# EAGLE design Pololu Magnetic Encoder (AS5050) (EAGLE 6.4)
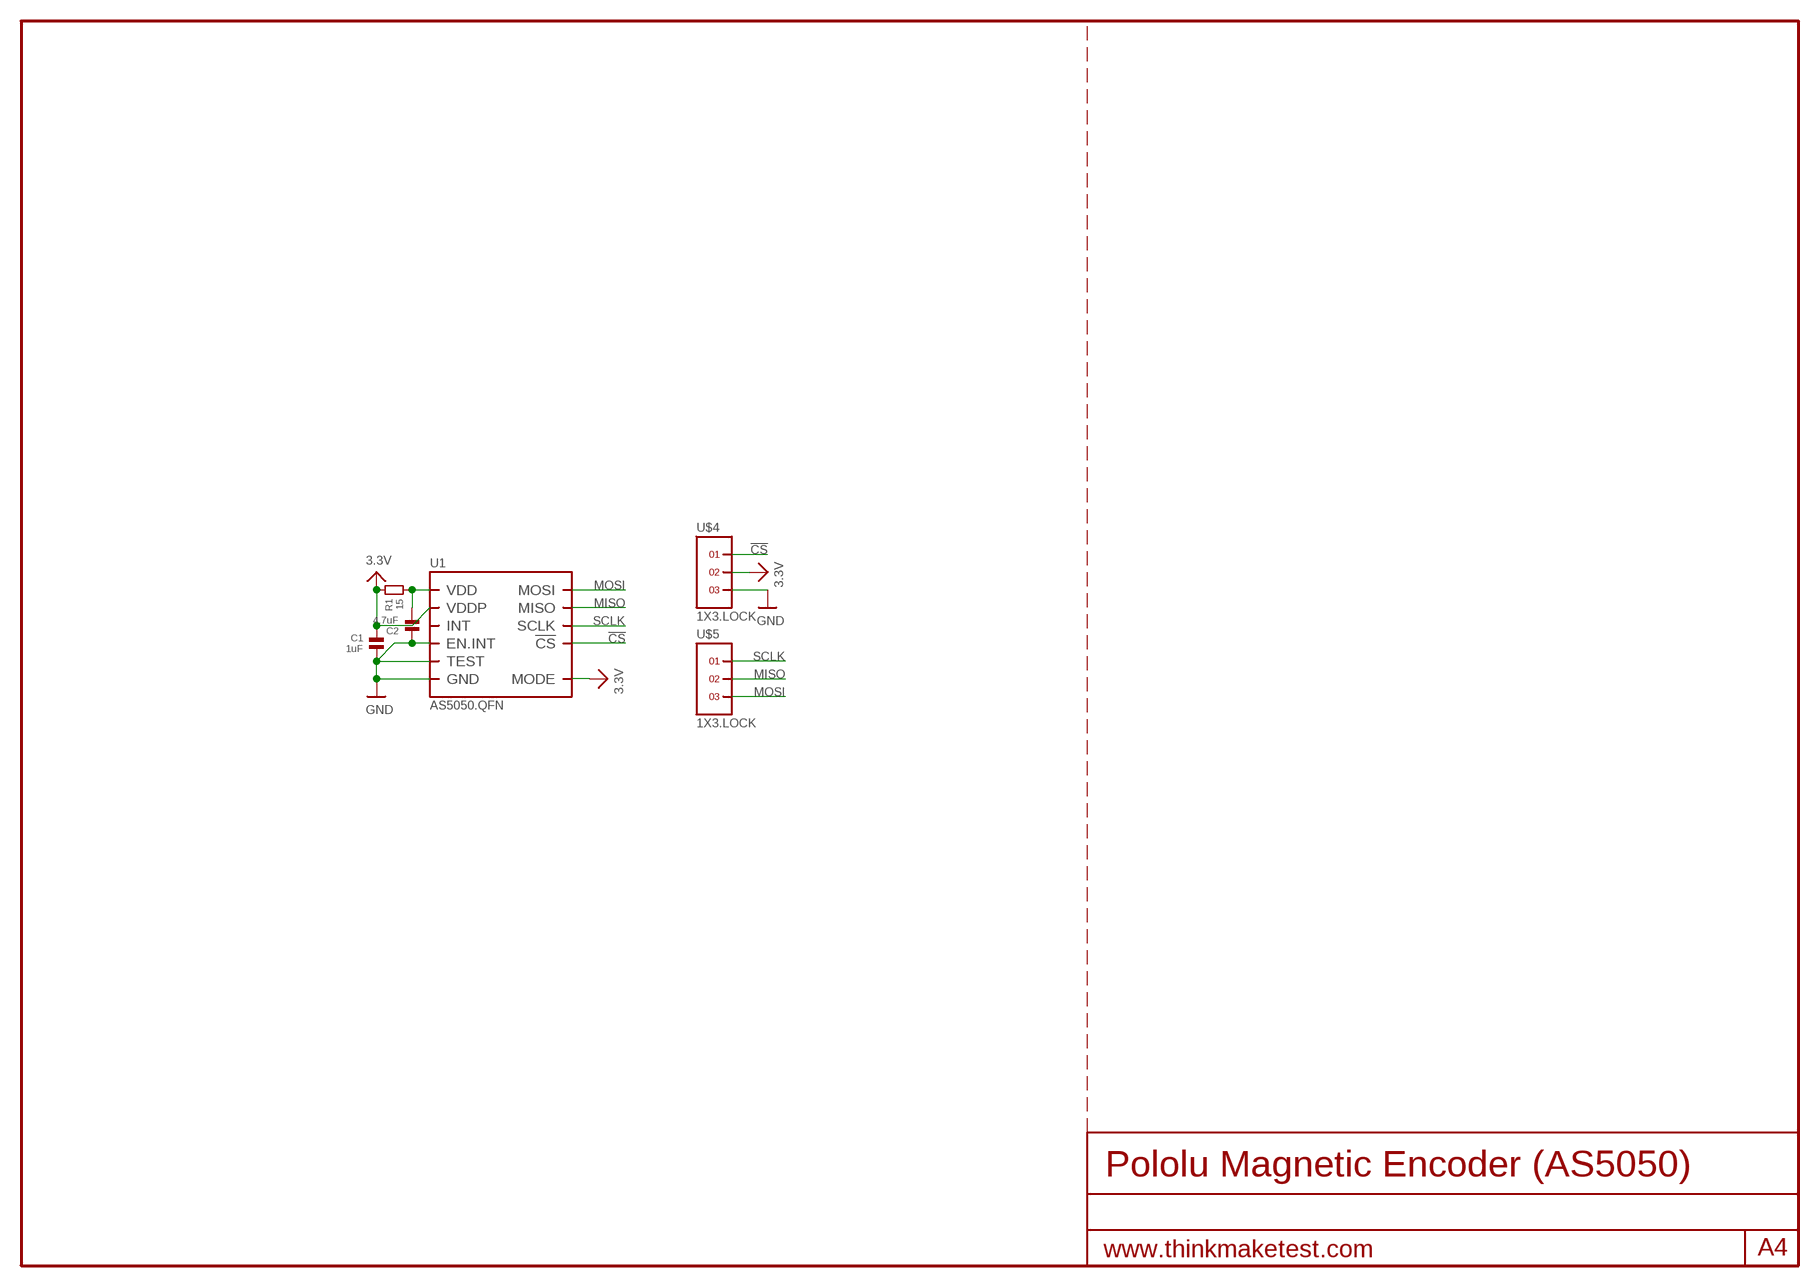
[diagram p0: schematic, sheet 1]

## Parts
C1  1uF  CAPACITOR.0603  [0603]
C2  4.7uF  CAPACITOR.0603  [0603]
R1  15  RESISTOR.0603  [0603]
U1  AS5050.QFN  [QFN.16]
U$4  1X3.LOCK  [1X3.LOCK]
U$5  1X3.LOCK  [1X3.LOCK]

## Nets
3.3V: C1.1 R1.1 U1.11(VDDP) U1.14(MODE) U$4.2
!CS: U1.4(!CS) U$4.1
GND: C1.2 C2.1 U1.9(TEST) U1.10(EN.INT) U1.13(GND) U$4.3
MISO: U1.2(MISO) U$5.2
MOSI: U1.1(MOSI) U$5.3
N$1: C2.2 R1.2 U1.12(VDD)
SCLK: U1.3(SCLK) U$5.1
Unconnected: U1.15(INT)

## Library data of the parts
C1 C2 = standardparts:CAPACITOR
R1 = standardparts:RESISTOR
U1 = austriamicrosystems:AS5050
U$4 U$5 = headers(.1in):1X3

## Board
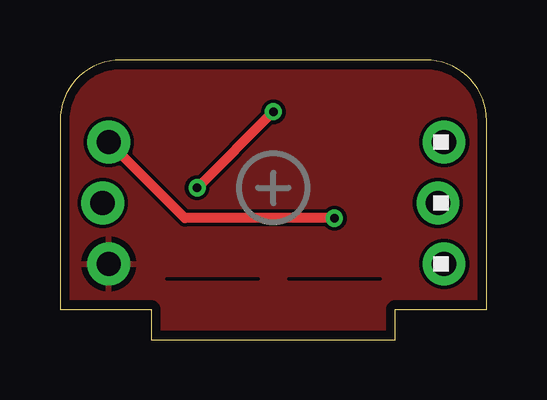
[diagram p1: board, top side]
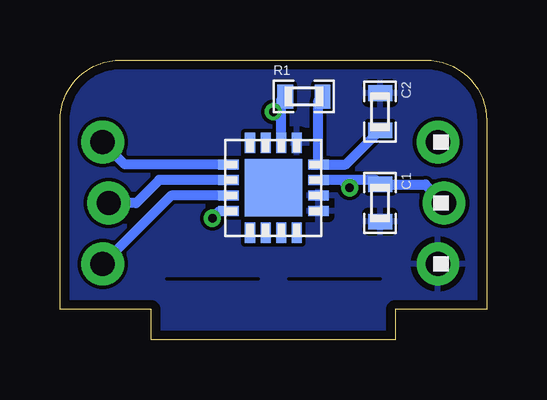
[diagram p2: board, bottom side, seen from below]

Size 17.78 x 11.68 mm. Coordinates in mm from the lower left corner, seen from the top.
Outline: 0,1.27 3.81,1.27 3.81,0 13.97,0 13.97,1.27 17.78,1.27 17.78,9.14 arc90 15.24,11.68 2.54,11.68 arc90 0,9.14 0,1.27
Copper layers (1*16): Top 0.0356mm / dielectric 1.5011mm / Bottom 0.0356mm
Design rules "OSHPark": minimum track width 6mil, minimum drill 13mil, track to track 6mil, track to pad 6mil, pad to pad 6mil, via to via 6mil, smd to smd 6mil, copper to edge 15mil, drill to drill 6mil, minimum pad ring 7mil, minimum via ring 7mil, stop-mask expansion 4mil, vias tented up to drill 16mil, thermal gap 10mil
tRestrict: 2 lines
bRestrict: 2 lines

### Footprints (pad centres in the part's own frame; a part is rotated, then mirrored left to right if it is on the bottom)
0603 = smd 0.65 x 1: 1 -0.775,0; 2 0.775,0
QFN.16 = smd 0.85 x 0.42: 1 -1.875,0.975; 2 -1.875,0.325; 3 -1.875,-0.325; 4 -1.875,-0.975; 9 1.875,-0.975; 10 1.875,-0.325; 11 1.875,0.325; 12 1.875,0.975 | smd 0.42 x 0.85: 5 -0.975,-1.875; 6 -0.325,-1.875; 7 0.325,-1.875; 8 0.975,-1.875; 13 0.975,1.875; 14 0.325,1.875; 15 -0.325,1.875; 16 -0.975,1.875 | smd 2.4 x 2.4: PAD 0,0
1X3.LOCK = drill 1.016 pad 1.778: 1 0,-0.127; 2 2.54,0.127; 3 5.08,-0.127

### Placement (x,y rotation side)
C1  4.45,5.71 270 bottom
C2  4.45,9.53 270 bottom
R1  7.62,10.16 0 bottom
U1  8.89,6.35 0 bottom
U$4  1.91,8.26 270 bottom
U$5  15.88,3.17 90 top

### Tracks (layer width: path | path; a pad name or v marks a point on that pad's centre or on a via)
3.3V  (via drill 0.36)
  Top 0.406: v8.89,9.53 v5.71,6.35
  Bottom 0.406: 6.04,6.67 4.63,6.67 C1.1 2.55,6.49 U$4.2 | U1.11 6.35,6.67 6.04,6.67 | R1.1 8.56,9.99 U1.14 8.56,9.2 v8.89,9.53 | v5.71,6.35 6.04,6.67
!CS  (via drill 0.36)
  Top 0.406: v11.43,5.08 5.21,5.08 U$4.1
  Bottom 0.406: U1.4 11.13,5.38 v11.43,5.08
GND
  pour Bottom (rank 6): 0,0 17.78,0 17.78,11.68 0,11.68
  pour Top (rank 6): 0,0 17.78,0 17.78,11.68 0,11.68
MISO
  Bottom 0.406: U1.2 13.64,6.67 14.61,5.71 U$5.2
MOSI
  Bottom 0.406: U1.1 15.07,7.33 U$5.3
N$1
  Bottom 0.406: R1.2 7.01,9.99 U1.12 5.87,7.33 C2.2
SCLK
  Bottom 0.406: U1.3 13.15,6.03 U$5.1

### Text on the board
tDocu: !CS | SCLK | 3.3v | MISO | GND | MOSI | Cruz Monrreal II | AnomalousMaker.com